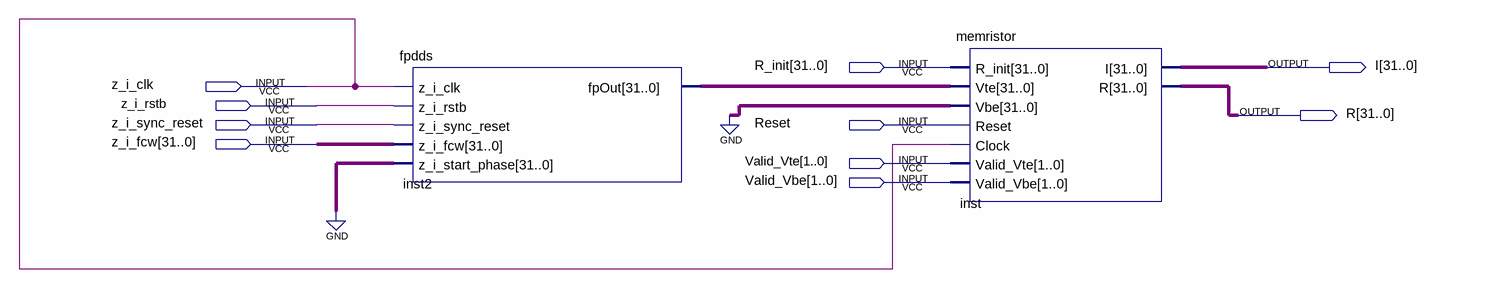
[diagram p0: schematic sheet]
// Quartus schematic memtester.bdf as structural Verilog: 2 symbols, 10 pins
module memtester (
  input  [31:0] R_init,
  input  z_i_clk,
  input  z_i_rstb,
  input  z_i_sync_reset,
  input  Reset,
  input  [31:0] z_i_fcw,
  input  [1:0] Valid_Vte,
  input  [1:0] Valid_Vbe,
  output [31:0] I,
  output [31:0] R
);

  wire [31:0] inst2_fpout;

  fpdds inst2 (
    .z_i_clk(z_i_clk), .z_i_rstb(z_i_rstb), .z_i_sync_reset(z_i_sync_reset), .z_i_fcw(z_i_fcw),
    .z_i_start_phase({32{1'b0}}), .fpOut(inst2_fpout));
  memristor inst (
    .R_init(R_init), .Vte(inst2_fpout), .Vbe({32{1'b0}}), .Reset(Reset), .Clock(z_i_clk),
    .Valid_Vte(Valid_Vte), .Valid_Vbe(Valid_Vbe), .I(I), .R(R));
endmodule
